# Altium schematic sheet Input.SchDoc
size A; SheetNumber: 3; SheetTotal: 7
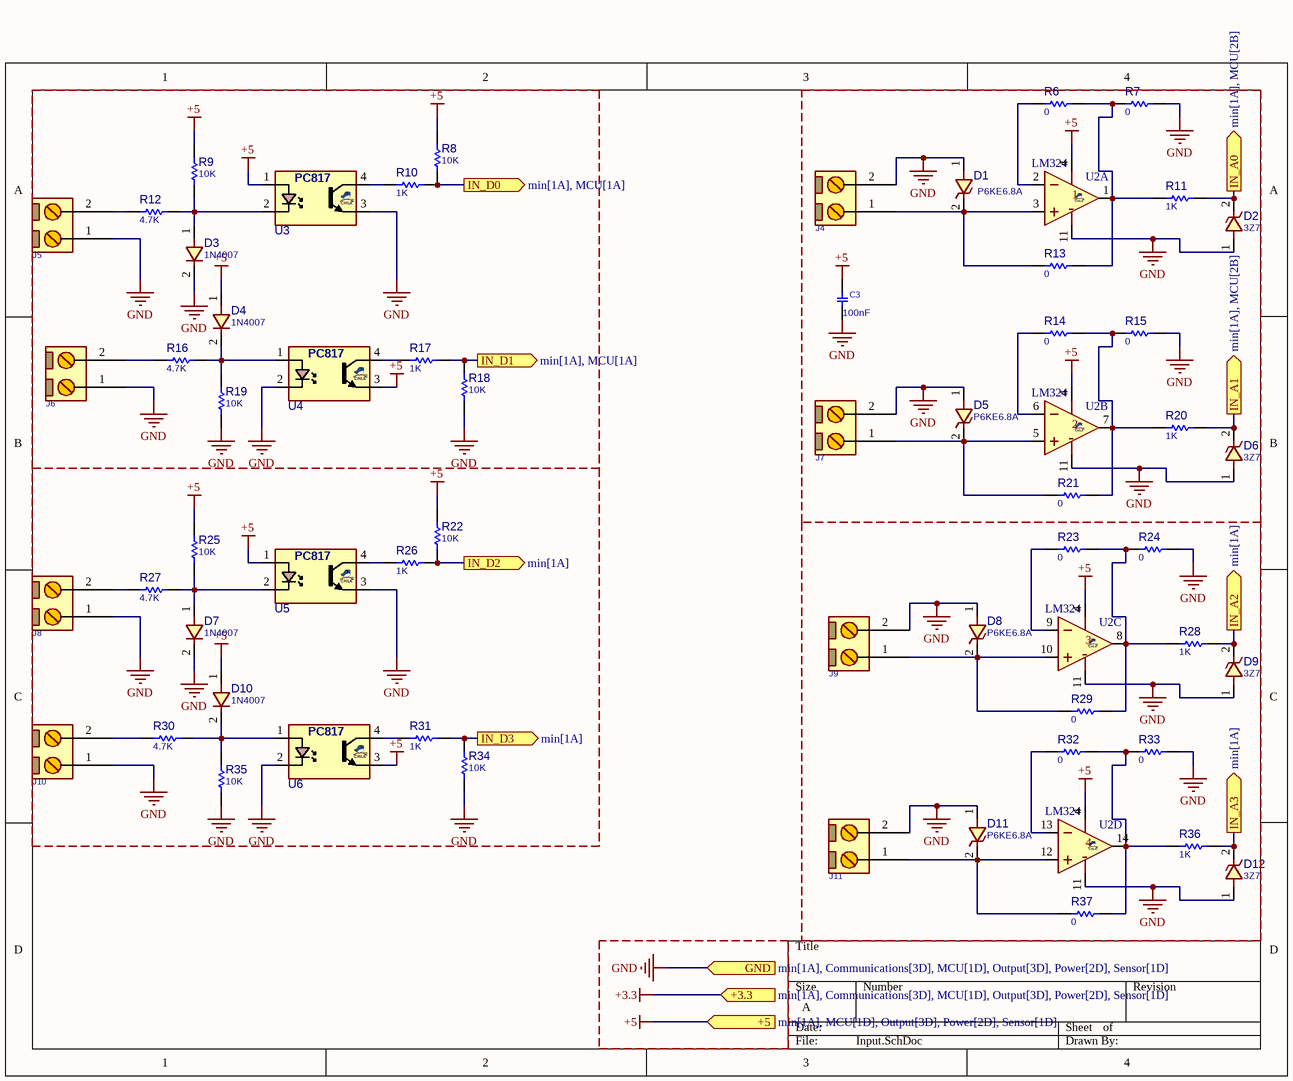
[diagram p0: Input.SchDoc]

## Parts
C3  100nF  [C1206]
D1  P6KE6.8A  [D_AX04_DO41]
D2  3Z7  [D_AX04_DO41]
D3  1N4007  [D_AX04_DO41]
D4  1N4007  [D_AX04_DO41]
D5  P6KE6.8A  [D_AX04_DO41]
D6  3Z7  [D_AX04_DO41]
D7  1N4007  [D_AX04_DO41]
D8  P6KE6.8A  [D_AX04_DO41]
D9  3Z7  [D_AX04_DO41]
D10  1N4007  [D_AX04_DO41]
D11  P6KE6.8A  [D_AX04_DO41]
D12  3Z7  [D_AX04_DO41]
J4  CONN_GMSTB2  [GMSTB762_2]  (value not drawn)
J5  CONN_GMSTB2  [GMSTB762_2]  (value not drawn)
J6  CONN_GMSTB2  [GMSTB762_2]  (value not drawn)
J7  CONN_GMSTB2  [GMSTB762_2]  (value not drawn)
J8  CONN_GMSTB2  [GMSTB762_2]  (value not drawn)
J9  CONN_GMSTB2  [GMSTB762_2]  (value not drawn)
J10  CONN_GMSTB2  [GMSTB762_2]  (value not drawn)
J11  CONN_GMSTB2  [GMSTB762_2]  (value not drawn)
R6  0  [R1206]
R7  0  [R1206]
R8  10K  [R1206]
R9  10K  [R1206]
R10  1K  [R1206]
R11  1K  [R1206]
R12  4.7K  [R1206]
R13  0  [R1206]
R14  0  [R1206]
R15  0  [R1206]
R16  4.7K  [R1206]
R17  1K  [R1206]
R18  10K  [R1206]
R19  10K  [R1206]
R20  1K  [R1206]
R21  0  [R1206]
R22  10K  [R1206]
R23  0  [R1206]
R24  0  [R1206]
R25  10K  [R1206]
R26  1K  [R1206]
R27  4.7K  [R1206]
R28  1K  [R1206]
R29  0  [R1206]
R30  4.7K  [R1206]
R31  1K  [R1206]
R32  0  [R1206]
R33  0  [R1206]
R34  10K  [R1206]
R35  10K  [R1206]
R36  1K  [R1206]
R37  0  [R1206]
U2  LM324  [DIP_14]  (parts A,B,C,D of 4)
U3  PC817  [DIP_4]  (value not drawn)
U4  PC817  [DIP_4]  (value not drawn)
U5  PC817  [DIP_4]  (value not drawn)
U6  PC817  [DIP_4]  (value not drawn)

## Ports
+3.3 (in, see min[1A], Communications[3D], MCU[1D], Output[3D], Power[2D], Sensor[1D]), +5 (in, see min[1A], MCU[1D], Output[3D], Power[2D], Sensor[1D]), GND (in, see min[1A], Communications[3D], MCU[1D], Output[3D], Power[2D], Sensor[1D]), IN_A0 (out, see min[1A], MCU[2B]), IN_A1 (out, see min[1A], MCU[2B]), IN_A2 (out, see min[1A]), IN_A3 (out, see min[1A]), IN_D0 (out, see min[1A], MCU[1A]), IN_D1 (out, see min[1A], MCU[1A]), IN_D2 (out, see min[1A]), IN_D3 (out, see min[1A])

## Nets
+3.3: port +3.3
+5: C3.1 D4.1 D10.1 R8.2 R9.2 R22.2 R25.2 U2.4(V+) U3.1(A) U4.3(E) U5.1(A) U6.3(E) ; port +5
GND: C3.2 D1.1 D2.1 D3.2 D5.1 D6.1 D7.2 D8.1 D9.1 D11.1 D12.1 J4.2 J5.1 J6.1 J7.2 J8.1 J9.2 J10.1 J11.2 R7.1 R15.1 R18.1 R19.1 R24.1 R33.1 R34.1 R35.1 U2.11(V-) U3.3(E) U4.2(K) U5.3(E) U6.2(K) ; port GND
IN_A0: D2.2 R11.2 ; port IN_A0
IN_A1: D6.2 R20.2 ; port IN_A1
IN_A2: D9.2 R28.2 ; port IN_A2
IN_A3: D12.2 R36.2 ; port IN_A3
IN_D0: R8.1 R10.2 ; port IN_D0
IN_D1: R17.2 R18.2 ; port IN_D1
IN_D2: R22.1 R26.2 ; port IN_D2
IN_D3: R31.2 R34.2 ; port IN_D3
NetD1_2: D1.2 J4.1 R13.2 U2.3(IN+)
NetD3_1: D3.1 R9.1 R12.1 U3.2(K)
NetD4_2: D4.2 R16.1 R19.2 U4.1(A)
NetD5_2: D5.2 J7.1 R21.2 U2.5(IN+)
NetD7_1: D7.1 R25.1 R27.1 U5.2(K)
NetD8_2: D8.2 J9.1 R29.2 U2.10(IN+)
NetD10_2: D10.2 R30.1 R35.2 U6.1(A)
NetD11_2: D11.2 J11.1 R37.2 U2.12(IN+)
NetJ5_2: J5.2 R12.2
NetJ6_2: J6.2 R16.2
NetJ8_2: J8.2 R27.2
NetJ10_2: J10.2 R30.2
NetR6_1: R6.1 R7.2 R11.1 R13.1 U2.1(OUT)
NetR6_2: R6.2 U2.2(IN-)
NetR10_1: R10.1 U3.4(C)
NetR14_1: R14.1 R15.2 R20.1 R21.1 U2.7(OUT)
NetR14_2: R14.2 U2.6(IN-)
NetR17_1: R17.1 U4.4(C)
NetR23_1: R23.1 R24.2 R28.1 R29.1 U2.8(OUT)
NetR23_2: R23.2 U2.9(IN-)
NetR26_1: R26.1 U5.4(C)
NetR31_1: R31.1 U6.4(C)
NetR32_1: R32.1 R33.2 R36.1 R37.1 U2.14(OUT)
NetR32_2: R32.2 U2.13(IN-)

## Library data of the parts
C3 = CAP_SMD_MLCC: CAP, MLCC; PARAM: C0G, 10%; DESC: CAP, MLCC, 1nF, 50V, C0G, 10%, 0402; MANF_P#: MANF_PART#; MANF: Murata; PARAM2: 50V; VALUE: 20pF; PRICE: 100= 1$; ASSEMBLY: ASSEMBLY
D1 D2 D5 D6 D8 D9 D11 D12 = DIODE_THD_ZENER: DIODE, ZENER, 0.2W, 15V; MANF: Diodes; DESC: DESCRIPTION; MANF_P#: ZENER15V; ASSEMBLY: ASSEMBLY; PRICE: PRICE; PARAM2: 0.2W; PARAM: 15V
  D1 D5 D8 D11: VALUE: P6KE6.8A
  D2 D6 D9 D12: VALUE: 3Z7
D3 D4 D7 D10 = DIODE_THD_1N4007: DIODE, GENERAL PURPOSE, 1000V/1A; MANF: Diodes; DESC: DESCRIPTION; PARAM: 1000V, 1.15V; PARAM2: 1.5A; ASSEMBLY: ASSEMBLY; PRICE: PRICE; MANF_P#: 1N4007; VALUE: 1N4007
J4-J11 = CONN_GMSTB762_2: CONN, PHOENIX GMSTB, 7.62mm pitch; MANF_P#: GMSTB 2,5/2-G-7,62; PARAM2: 630V; PARAM: 12A; VALUE: CONN_GMSTB2
R6-R37 = RES_SMD: RESISTOR, SMD; PARAM: -W; DESC: DESCRIPTION; DIST#: MOUSER; PARAM2: 1%; VALUE: 470; MANF_P#: -; MANF: -; ASSEMBLY: ASSEMBLY; PRICE: 100= 0.5$
U2 = LM324_DIP14: AMP, Quad, Single-Supply; MANF: ON, Texas Instruments, ST; MANF_P#: LM324AN; VALUE: LM324
U3-U6 = OPTC_TR4P_PC817: OPTOCOUPLER, TRANSISTOR, 4PIN; PARAM: IF=20mA; PARAM2: VCE = 35V; MANF: SHARP; MANF_P#: PC817; PRICE: -; VALUE: PC817; PACKAGE: DIP-4